# EAGLE schematic DoublePN-OK (EAGLE 8.3.1)
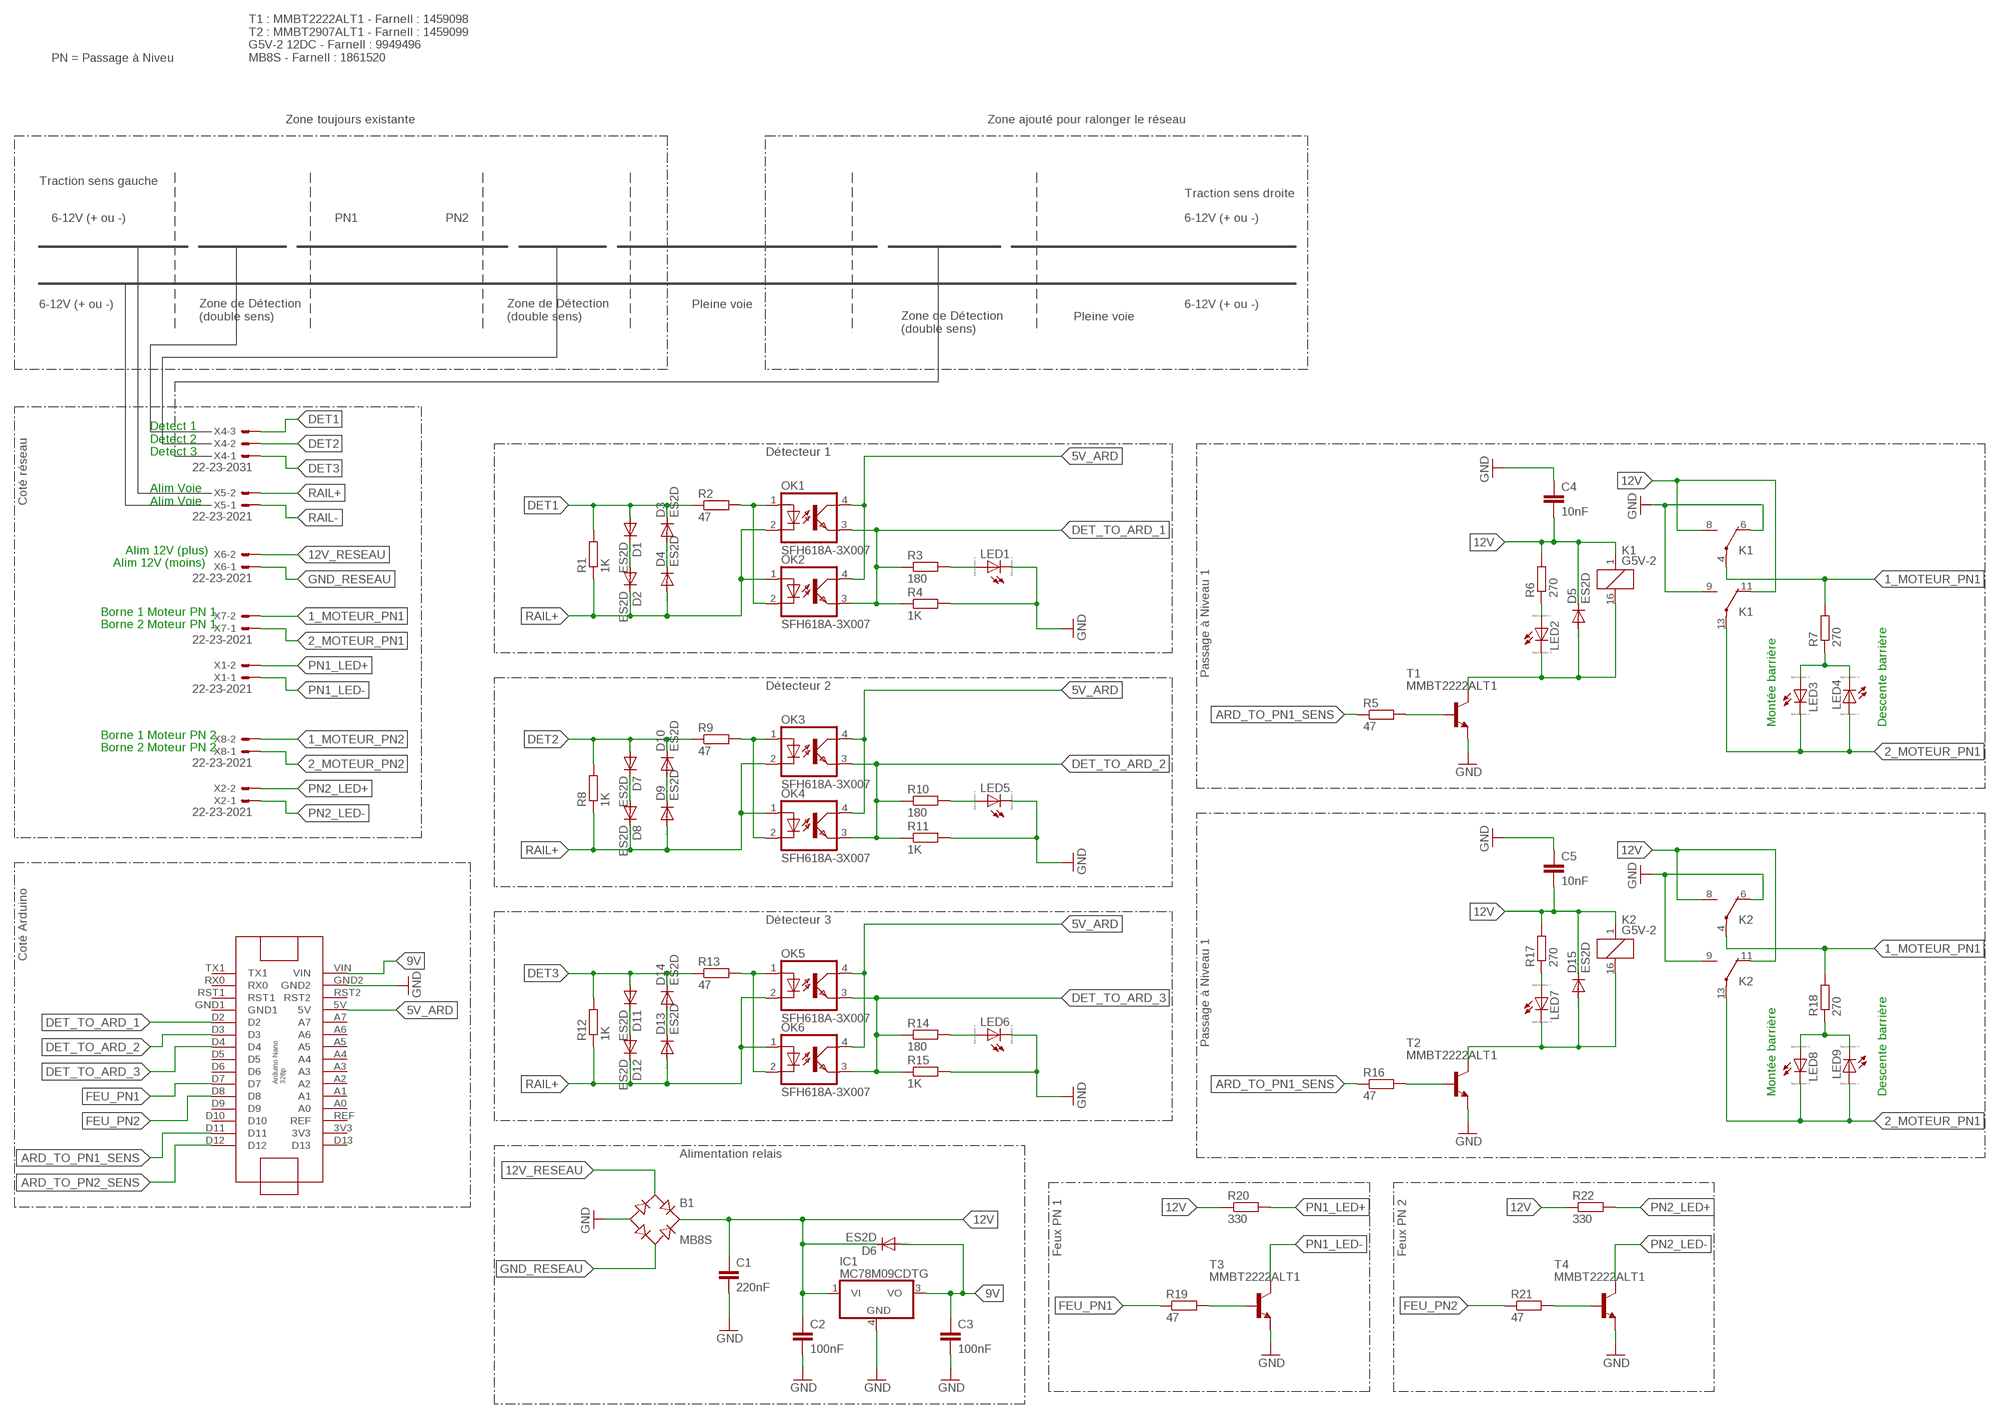
[diagram p0: schematic, sheet 1]

## Parts
ARDUINO-NANO1  ARDUINO-NANO  [ARDUINO-NANO]
B1  MB8S  [SOIC-4]
C1  220nF  C-EUC0805  [C0805]
C2  100nF  C-EUC0805  [C0805]
C3  100nF  C-EUC0805  [C0805]
C4  10nF  C-EUC0805  [C0805]
C5  10nF  C-EUC0805  [C0805]
D1  ES2D  [SMB]
D2  ES2D  [SMB]
D3  ES2D  [SMB]
D4  ES2D  [SMB]
D5  ES2D  [SMB]
D6  ES2D  [SMB]
D7  ES2D  [SMB]
D8  ES2D  [SMB]
D9  ES2D  [SMB]
D10  ES2D  [SMB]
D11  ES2D  [SMB]
D12  ES2D  [SMB]
D13  ES2D  [SMB]
D14  ES2D  [SMB]
D15  ES2D  [SMB]
IC1  MC78M09CDTG  [DPACK_3]
K1  G5V-2  [G5V-2]
K2  G5V-2  [G5V-2]
LED1  LED_ESML0603  [LED_SML0603]
LED2  LED_ESML0603  [LED_SML0603]
LED3  LED_ESML0603  [LED_SML0603]
LED4  LED_ESML0603  [LED_SML0603]
LED5  LED_ESML0603  [LED_SML0603]
LED6  LED_ESML0603  [LED_SML0603]
LED7  LED_ESML0603  [LED_SML0603]
LED8  LED_ESML0603  [LED_SML0603]
LED9  LED_ESML0603  [LED_SML0603]
OK1  SFH618A-3X007  [SMD4-7]
OK2  SFH618A-3X007  [SMD4-7]
OK3  SFH618A-3X007  [SMD4-7]
OK4  SFH618A-3X007  [SMD4-7]
OK5  SFH618A-3X007  [SMD4-7]
OK6  SFH618A-3X007  [SMD4-7]
R1  1K  R-EU_R0805  [R0805]
R2  47  R-EU_R0805  [R0805]
R3  180  R-EU_R0805  [R0805]
R4  1K  R-EU_R0805  [R0805]
R5  47  R-EU_R0805  [R0805]
R6  270  R-EU_R0805  [R0805]
R7  270  R-EU_R0805  [R0805]
R8  1K  R-EU_R0805  [R0805]
R9  47  R-EU_R0805  [R0805]
R10  180  R-EU_R0805  [R0805]
R11  1K  R-EU_R0805  [R0805]
R12  1K  R-EU_R0805  [R0805]
R13  47  R-EU_R0805  [R0805]
R14  180  R-EU_R0805  [R0805]
R15  1K  R-EU_R0805  [R0805]
R16  47  R-EU_R0805  [R0805]
R17  270  R-EU_R0805  [R0805]
R18  270  R-EU_R0805  [R0805]
R19  47  R-EU_R0805  [R0805]
R20  330  R-EU_R0805  [R0805]
R21  47  R-EU_R0805  [R0805]
R22  330  R-EU_R0805  [R0805]
T1  MMBT2222ALT1  MMBT2222ALT1-NPN-SOT23-BEC  [SOT23-BEC]
T2  MMBT2222ALT1  MMBT2222ALT1-NPN-SOT23-BEC  [SOT23-BEC]
T3  MMBT2222ALT1  MMBT2222ALT1-NPN-SOT23-BEC  [SOT23-BEC]
T4  MMBT2222ALT1  MMBT2222ALT1-NPN-SOT23-BEC  [SOT23-BEC]
X1  22-23-2021  [22-23-2021]
X2  22-23-2021  [22-23-2021]
X4  22-23-2031  [22-23-2031]
X5  22-23-2021  [22-23-2021]
X6  22-23-2021  [22-23-2021]
X7  22-23-2021  [22-23-2021]
X8  22-23-2021  [22-23-2021]

## Nets
1_MOTEUR_PN1: K1.4(1:P) K2.4(1:P) R7.2 R18.2 X7.2
1_MOTEUR_PN2: X8.2
2_MOTEUR_PN1: K1.13(2:P) K2.13(2:P) LED3.C LED4.A LED8.C LED9.A X7.1
2_MOTEUR_PN2: X8.1
5V_ARD: ARDUINO-NANO1.5V OK1.4(COL) OK2.4(COL) OK3.4(COL) OK4.4(COL) OK5.4(COL) OK6.4(COL)
9V: ARDUINO-NANO1.VIN C3.1 D6.A IC1.3(VO)
12V: B1.+ C1.1 C2.1 C4.2 C5.2 D5.C D6.C D15.C IC1.1(VI) K1.1 K1.8(1:S) K1.11(2:O) K2.1 K2.8(1:S) K2.11(2:O) R6.2 R17.2 R20.1 R22.1
12V_RESEAU: B1.~1(AC1) X6.2
ARD_TO_PN1_SENS: ARDUINO-NANO1.D11 R5.1 R16.1
ARD_TO_PN2_SENS: ARDUINO-NANO1.D12
DET1: D1.A D3.C R1.2 R2.1 X4.3
DET2: D7.A D10.C R8.2 R9.1 X4.2
DET3: D11.A D14.C R12.2 R13.1 X4.1
DET_TO_ARD_1: ARDUINO-NANO1.D2 OK1.3(EMIT) OK2.3(EMIT) R3.1 R4.1
DET_TO_ARD_2: ARDUINO-NANO1.D3 OK3.3(EMIT) OK4.3(EMIT) R10.1 R11.1
DET_TO_ARD_3: ARDUINO-NANO1.D4 OK5.3(EMIT) OK6.3(EMIT) R14.1 R15.1
FEU_PN1: ARDUINO-NANO1.D7 R19.1
FEU_PN2: ARDUINO-NANO1.D8 R21.1
GND: ARDUINO-NANO1.GND2 B1.- C1.2 C2.2 C3.2 C4.1 C5.1 IC1.4(GND) K1.6(1:O) K1.9(2:S) K2.6(1:O) K2.9(2:S) LED1.C LED5.C LED6.C R4.2 R11.2 R15.2 T1.E T2.E T3.E T4.E
GND_RESEAU: B1.~2(AC2) X6.1
N$1: OK1.1(A) OK2.2(C) R2.2
N$2: D1.C D2.A
N$3: D3.A D4.C
N$4: LED3.A LED4.C R7.1
N$5: R5.2 T1.B
N$6: LED1.A R3.2
N$7: D5.A K1.16 LED2.C T1.C
N$8: D7.C D8.A
N$9: LED2.A R6.1
N$10: D9.C D10.A
N$11: OK3.1(A) OK4.2(C) R9.2
N$12: LED5.A R10.2
N$13: D11.C D12.A
N$14: D13.C D14.A
N$15: OK5.1(A) OK6.2(C) R13.2
N$16: LED6.A R14.2
N$18: D15.A K2.16 LED7.C T2.C
N$19: LED7.A R17.1
N$20: LED8.A LED9.C R18.1
N$21: R21.2 T4.B
N$22: R19.2 T3.B
N$23: R16.2 T2.B
PN1_LED+: R20.2 X1.2
PN1_LED-: T3.C X1.1
PN2_LED+: R22.2 X2.2
PN2_LED-: T4.C X2.1
RAIL+: D2.C D4.A D8.C D9.A D12.C D13.A OK1.2(C) OK2.1(A) OK3.2(C) OK4.1(A) OK5.2(C) OK6.1(A) R1.1 R8.1 R12.1 X5.2
RAIL-: X5.1
Unconnected: ARDUINO-NANO1.3V3 ARDUINO-NANO1.A0 ARDUINO-NANO1.A1 ARDUINO-NANO1.A2 ARDUINO-NANO1.A3 ARDUINO-NANO1.A4 ARDUINO-NANO1.A5 ARDUINO-NANO1.A6 ARDUINO-NANO1.A7 ARDUINO-NANO1.D5 ARDUINO-NANO1.D6 ARDUINO-NANO1.D9 ARDUINO-NANO1.D10 ARDUINO-NANO1.D13 ARDUINO-NANO1.GND1 ARDUINO-NANO1.REF ARDUINO-NANO1.RST1 ARDUINO-NANO1.RST2 ARDUINO-NANO1.RX0 ARDUINO-NANO1.TX1

## Notes on the sheet
- PN = Passage à Niveu
- T1 : MMBT2222ALT1 - Farnell : 1459098
  T2 : MMBT2907ALT1 - Farnell : 1459099
  G5V-2 12DC - Farnell : 9949496
  MB8S - Farnell : 1861520
- Zone toujours existante | Zone ajouté pour ralonger le réseau
- Traction sens gauche
- Traction sens droite
- 6-12V (+ ou -) | PN1 | PN2 | 6-12V (+ ou -)
- 6-12V (+ ou -) | Pleine voie | 6-12V (+ ou -)
- Zone de Détection
  (double sens)
- Zone de Détection
  (double sens)
- Pleine voie
- Zone de Détection
  (double sens)
- Detect 1
  Detect 2
  Detect 3
- Détecteur 1
- Coté réseau
- Alim Voie
  Alim Voie
- Alim 12V (plus)
- Alim 12V (moins)
- Borne 1 Moteur PN 1
- Borne 2 Moteur PN 1
- Passage à Niveau 1
- Détecteur 2
- Montée barrière | Descente barrière
- Borne 1 Moteur PN 2
- Borne 2 Moteur PN 2
- Détecteur 3
- Coté Arduino
- Passage à Niveau 1
- Montée barrière | Descente barrière
- Alimentation relais
- Feux PN 1 | Feux PN 2

## Library data of the parts
ARDUINO-NANO1 = Arduino-nano:ARDUINO-NANO
B1 = rectifier:MB*S: Bridge Rectifier Source: http://www.fairchildsemi.com/ds/MB/MB6S.pdf
C1-C5 = rcl:C-EU: CAPACITOR, European symbol
D1-D15 = diode:ES2D: DIODE super fast rectifier, 2 A
IC1 = linear:MC78M: 500 mA Positive Voltage Regulators Source: Data sheet <http://www.onsemi.com/pub_link/Collateral/MC78M00-D.PDF>
K1 K2 = relay:G5V-2: OMRON PCB Relay Source: http://www.omron.com/ecb/products/pdf/en-g5v2.pdf; MPN: G5V-2 5DC; OC_FARNELL: 9949488; OC_NEWARK: 78K5703
LED1-LED9 = eagle-ltspice:LED_E: LED Source: http://www.osram.convergy.de Source: www.luxeon.com Source: www.kingbright.com; SPICEMODEL: NONE; SPICEPREFIX: D; SPICETYPE: diode
OK1-OK6 = optocoupler:SFH618?*: Optocoupler, Phototransistor Output, Low Input Current Source: Data sheet <http://www.vishay.com/docs/83673/sfh618.pdf>; OC_FARNELL: unknown; OC_NEWARK: unknown
R1-R22 = rcl:R-EU_: RESISTOR, European symbol
T1-T4 = transistor:*-NPN-: NPN Transistror BF959 corrected 2008.03.06
X1 X2 X5-X8 = con-molex:22-23-2021: .100" (2.54mm) Center Header - 2 Pin; MF: MOLEX; MPN: 22-23-2021; OC_FARNELL: 1462926; OC_NEWARK: 25C3832
X4 = con-molex:22-23-2031: .100" (2.54mm) Center Header - 3 Pin; MF: MOLEX; MPN: 22-23-2031; OC_FARNELL: 1462950; OC_NEWARK: 30C0862